# EAGLE design ESPmotorver4 (EAGLE 9.6.2)
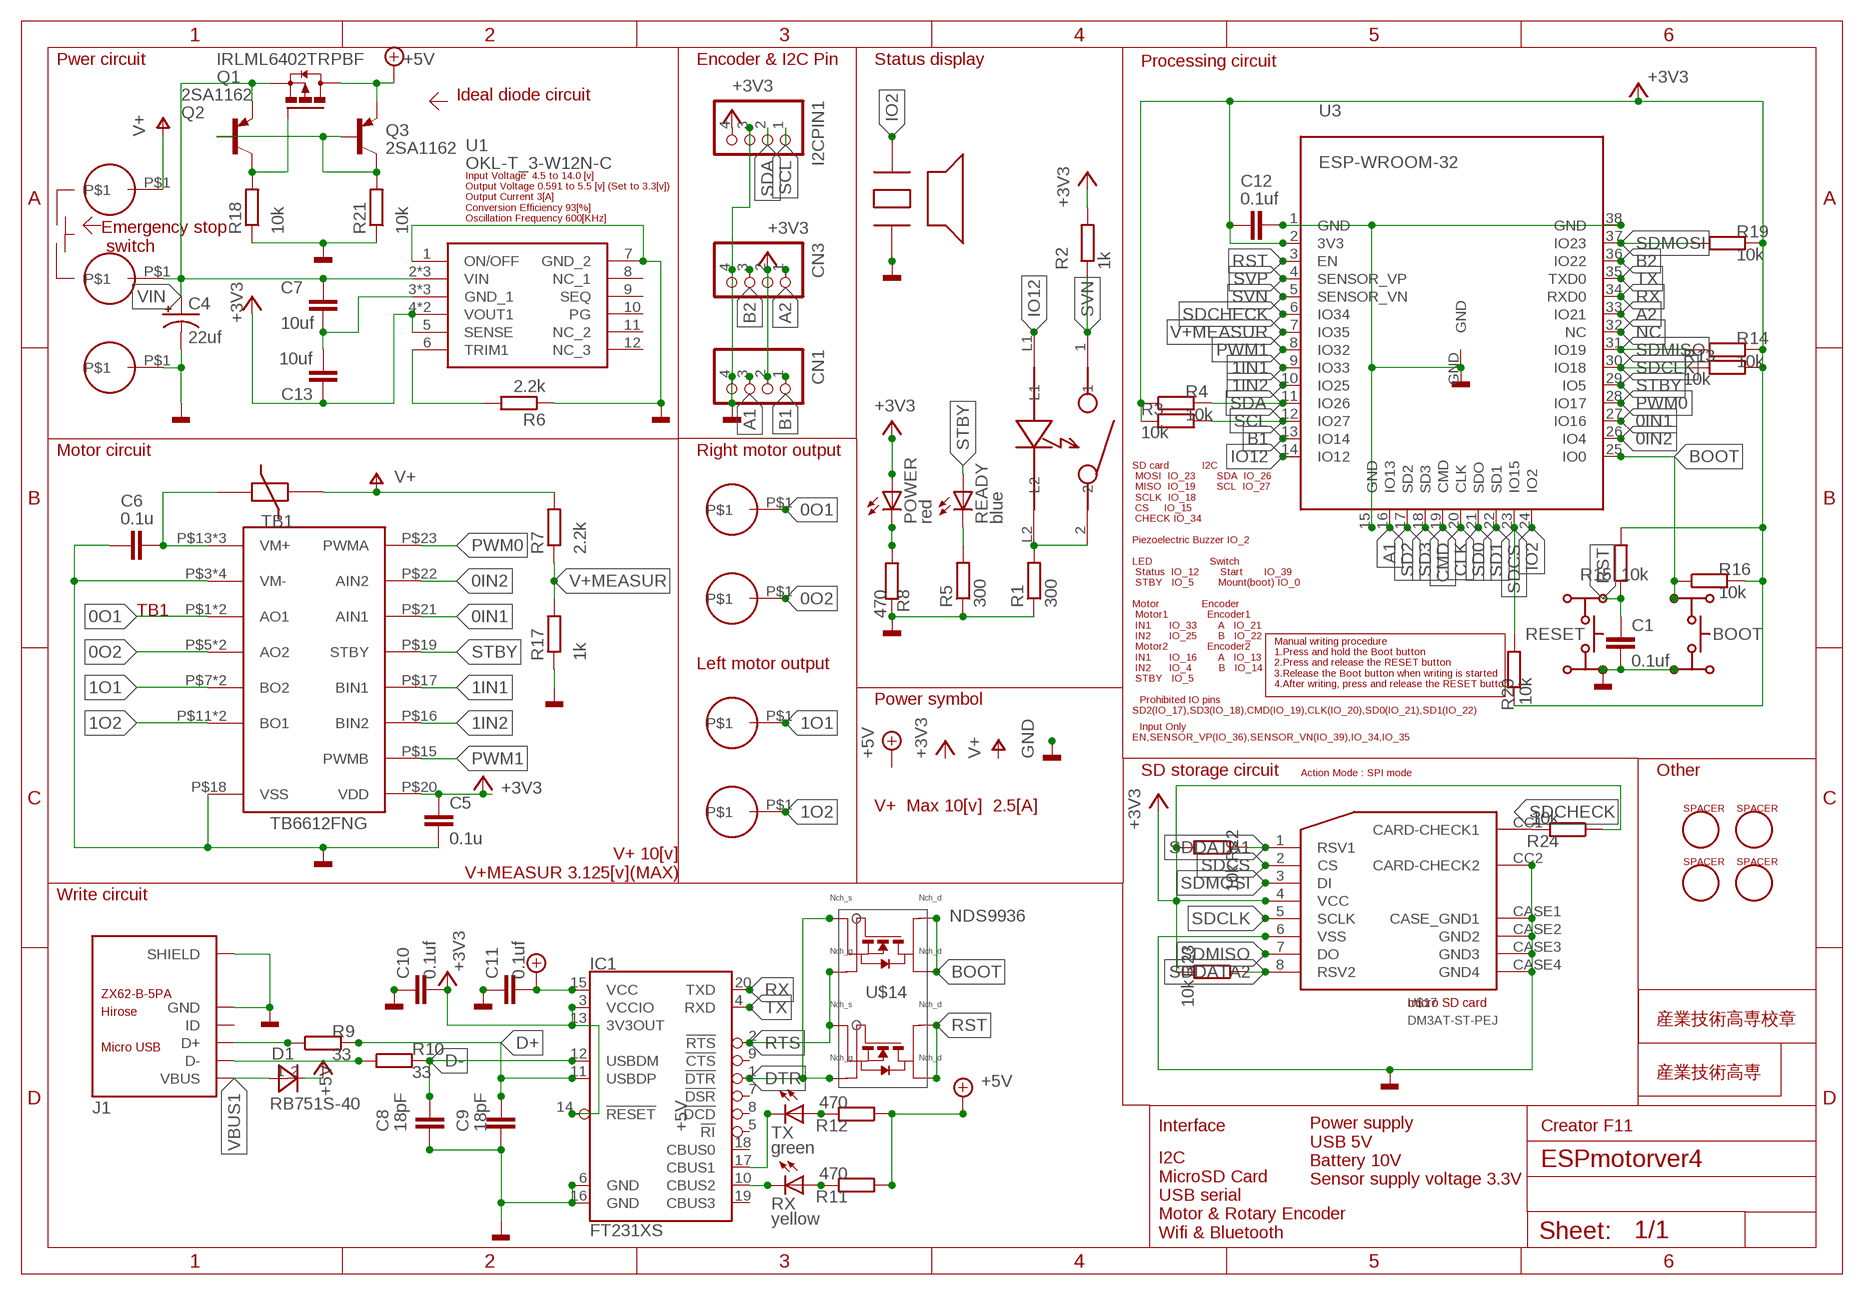
[diagram p0: schematic, sheet 1]

## Parts
BOOT  TACTSWITCH-4PSKRP  [SKRP]
C1  0.1uf  C-EUC0603K  [C0603K]
C4  22uf  CPOL-USCT3528  [CT3528]
C5  0.1u  C-EUC0603  [C0603]
C6  0.1u  C-EUC0603  [C0603]
C7  10uf  C-EUC0805  [C0805]
C8  18pF  C-EUC0603  [C0603]
C9  18pF  C-EUC0603  [C0603]
C10  0.1uf  C-EUC0603K  [C0603K]
C11  0.1uf  C-EUC0603K  [C0603K]
C12  0.1uf  C-EUC0603K  [C0603K]
C13  10uf  C-EUC0805  [C0805]
CN1  S4B-XH-A  [S4B-XH-A]
CN3  S4B-XH-A  [S4B-XH-A]
D1  RB751S-40  [EMD2]
EM  PV-3  [PV-3]
GND  PV-3  [PV-3]
I2CPIN1  S4B-XH-A  [S4B-XH-A]
IC1  FT231XS  [SSOP20]
J1  ZX62-B-5PA  [ZX62-B-5PA(11)]
POWER  red  LEDCHIPLED_0805  [CHIPLED_0805]
Q1  IRLML6402TRPBF  [SOT23]
Q2  2SA1162  MMUN2114LT1  [SC59-BEC]
Q3  2SA1162  MMUN2114LT1  [SC59-BEC]
R1  300  R-EU_R0603  [R0603]
R2  1k  R-EU_R0603  [R0603]
R3  10k  R-EU_R0603  [R0603]
R4  10k  R-EU_R0603  [R0603]
R5  300  R-EU_R0603  [R0603]
R6  2.2k  R-EU_R0603  [R0603]
R7  2.2k  R-EU_R0603  [R0603]
R8  470  R-EU_R0603  [R0603]
R9  33  R-EU_R0603  [R0603]
R10  33  R-EU_R0603  [R0603]
R11  470  R-EU_R0603  [R0603]
R12  470  R-EU_R0603  [R0603]
R13  10k  R-EU_R0603  [R0603]
R14  10k  R-EU_R0603  [R0603]
R15  10k  R-EU_R0603  [R0603]
R16  10k  R-EU_R0603  [R0603]
R17  1k  R-EU_R0603  [R0603]
R18  10k  R-EU_R0603  [R0603]
R19  10k  R-EU_R0603  [R0603]
R20  10k  R-EU_R0603  [R0603]
R21  10k  R-EU_R0603  [R0603]
R22  10k  R-EU_R0603  [R0603]
R23  10k  R-EU_R0603  [R0603]
R24  10k  R-EU_R0603  [R0603]
READY  blue  LEDCHIPLED_0805  [CHIPLED_0805]
RESET  TACTSWITCH-4PSKRP  [SKRP]
RX  yellow  LEDCHIPLED_0805  [CHIPLED_0805]
SW  TSHD-T2.8T2  [LEDSWITCH]
TB1  TB6612FNG  [TB6612FNG]
TX  green  LEDCHIPLED_0805  [CHIPLED_0805]
U1  OKL-T_3-W12N-C  [OKL-T3-W12]
U3  ESP-WROOM-32  [ESP-WROOM-32]
U$1  SCHOOLMARK1  [SCHOOLMARK1]
U$3  SCHOOLMARK2  [SCHOOLMARK2]
U$6  PKLCS1212E4001-R1  [SMD_SOUNDER]
U$7  PV-3  [PV-3]
U$8  SPACER  [SPACER]
U$9  PV-3  [PV-3]
U$10  PV-3  [PV-3]
U$11  SPACER  [SPACER]
U$12  SPACER  [SPACER]
U$13  SPACER  [SPACER]
U$14  NDS9936  [SO-8]
U$15  PV-3  [PV-3]
U$16  SMD1812  [SMD1812]
U$17  DM3AT-ST-PEJ  [DM3AT-SF-PEJ]
VIN  PV-3  [PV-3]

## Nets
0IN1: TB1.P$21(AIN1) U3.27(IO16)
0IN2: TB1.P$22(AIN2) U3.26(IO4)
0O1: TB1.P$1(AO1) TB1.P$2(AO1) U$7.P$1
0O2: TB1.P$5(AO2) TB1.P$6(AO2) U$9.P$1
1IN1: TB1.P$17(BIN1) U3.9(IO33)
1IN2: TB1.P$16(BIN2) U3.10(IO25)
1O1: TB1.P$7(BO2) TB1.P$8(BO2) U$10.P$1
1O2: TB1.P$11(BO1) TB1.P$12(BO1) U$15.P$1
+3V3: C5.1 C10.2 C12.2 C13.1 CN1.2 CN3.2 I2CPIN1.4 IC1.3(VCCIO) IC1.13(3V3OUT) IC1.14(!RESET) POWER.A R2.2 R3.1 R4.1 R13.2 R14.2 R15.2 R16.2 R19.2 R20.1 R22.2 R23.2 R24.1 TB1.P$20(VDD) U1.4(VOUT1) U1.5(SENSE) U1.17(VOUT1) U3.2(3V3) U$17.4(VCC)
+5V: C11.2 D1.2(C) IC1.15(VCC) Q1.3(D) Q3.E R11.1 R12.1
A1: CN1.3 U3.16(IO13)
A2: CN3.1 U3.33(IO21)
B1: CN1.1 U3.13(IO14)
B2: CN3.3 U3.36(IO22)
BOOT: BOOT.4 R16.1 U3.25(IO0) U$14.7 U$14.8
CLK: U3.20(CLK)
CMD: U3.19(CMD)
D+: C9.1 IC1.11(USBDP) R9.2
D-: C8.1 IC1.12(USBDM) R10.2
DTR: IC1.1(!DTR) U$14.1 U$14.4
GND: BOOT.2 C1.2 C4.- C5.2 C6.2 C7.2 C8.2 C9.2 C10.1 C11.1 C12.1 C13.2 CN1.4 CN3.4 GND.P$1 I2CPIN1.3 IC1.6(GND) IC1.16(GND) J1.5(GND) J1.SH1(SHIELD) J1.SH2(SHIELD) J1.SH3(SHIELD) J1.SH4(SHIELD) J1.SH5(SHIELD) J1.SH6(SHIELD) R1.1 R5.1 R6.1 R8.2 R17.1 R18.1 R21.1 RESET.1 TB1.P$3(VM-) TB1.P$4(VM-) TB1.P$9(VM-) TB1.P$10(VM-) TB1.P$18(VSS) U1.1(ON/OFF) U1.3(GND_1) U1.7(GND_2) U1.15(GND_1) U1.16(GND_1) U3.1(GND) U3.15(GND) U3.38(GND) U3.GND U$6.P$2 U$17.6(VSS) U$17.CASE1(CASE_GND1) U$17.CASE2(GND2) U$17.CASE3(GND3) U$17.CASE4(GND4) U$17.CC2(CARD-CHECK2)
IO2: U3.24(IO2) U$6.P$1
IO12: SW.L1 U3.14(IO12)
N$1: R1.2 SW.2 SW.L2
N$2: J1.2(D-) R10.1
N$3: C6.1 TB1.P$13(VM+) TB1.P$14(VM+) TB1.P$24(VM+) U$16.P$2
N$4: R6.2 U1.6(TRIM1)
N$5: J1.3(D+) R9.1
N$6: Q2.B Q3.B Q3.C R21.2
N$7: R5.2 READY.C
N$8: Q1.1(G) Q2.C R18.2
N$10: R11.2 RX.A
N$12: IC1.10(CBUS2) RX.C
N$13: R12.2 TX.A
N$14: POWER.C R8.1
N$19: IC1.17(CBUS1) TX.C
NC: U3.32(NC)
PWM0: TB1.P$23(PWMA) U3.28(IO17)
PWM1: TB1.P$15(PWMB) U3.8(IO32)
RST: C1.1 R15.1 RESET.3 U3.3(EN) U$14.5 U$14.6
RTS: IC1.2(!RTS) U$14.2 U$14.3
RX: IC1.20(TXD) U3.34(RXD0)
SCL: I2CPIN1.1 R3.2 U3.12(IO27)
SD0: U3.21(SDO)
SD1: U3.22(SD1)
SD2: U3.17(SD2)
SD3: U3.18(SD3)
SDA: I2CPIN1.2 R4.2 U3.11(IO26)
SDCHECK: R24.2 U3.6(IO34) U$17.CC1(CARD-CHECK1)
SDCLK: R13.1 U3.30(IO18) U$17.5(SCLK)
SDCS: R20.2 U3.23(IO15) U$17.2(CS)
SDDATA1: R22.1 U$17.1(RSV1)
SDDATA2: R23.1 U$17.8(RSV2)
SDMISO: R14.1 U3.31(IO19) U$17.7(DO)
SDMOSI: R19.1 U3.37(IO23) U$17.3(DI)
STBY: READY.A TB1.P$19(STBY) U3.29(IO5)
SVN: R2.1 SW.1 U3.5(SENSOR_VN)
SVP: U3.4(SENSOR_VP)
TX: IC1.4(RXD) U3.35(TXD0)
V+: EM.P$1 R7.2 U$16.P$1
V+MEASUR: R7.1 R17.2 U3.7(IO35)
VBUS1: D1.1(A) J1.1(VBUS)
VIN: C4.+ C7.1 Q1.2(S) Q2.E U1.2(VIN) U1.13(VIN) U1.14(VIN) VIN.P$1
Unconnected: BOOT.1 BOOT.3 IC1.5(!RI) IC1.7(!DSR) IC1.8(!DCD) IC1.9(!CTS) IC1.18(CBUS0) IC1.19(CBUS3) J1.4(ID) RESET.2 RESET.4 U1.8(NC_1) U1.9(SEQ) U1.10(PG) U1.11(NC_2) U1.12(NC_3)

## Notes on the sheet
- Pwer circuit | Encoder & I2C Pin | Status display | Processing circuit
- Ideal diode circuit
- Input Voltage  4.5 to 14.0 [v]
  Output Voltage 0.591 to 5.5 [v] (Set to 3.3[v])
  Output Current 3[A]
  Conversion Efficiency 93[%]
  Oscillation Frequency 600[KHz]
- Emergency stop
   switch
- Motor circuit | Right motor output
- Left motor output
- Manual writing procedure
  1.Press and hold the Boot button
  2.Press and release the RESET button
  3.Release the Boot button when writing is started
  4.After writing, press and release the RESET button
- Power symbol
- SD card           I2C
   MOSI  IO_23       SDA  IO_26
   MISO  IO_19       SCL  IO_27
   SCLK  IO_18
   CS     IO_15
   CHECK IO_34
  
  Piezoelectric Buzzer IO_2
  
  LED                   Switch
   Status  IO_12       Start       IO_39
   STBY   IO_5        Mount(boot) IO_0
  
  Motor              Encoder
   Motor1             Encoder1
   IN1      IO_33       A   IO_21
   IN2      IO_25       B   IO_22
   Motor2             Encoder2
   IN1      IO_16       A   IO_13
   IN2      IO_4         B   IO_14
   STBY   IO_5 
  
  ※Prohibited IO pins
  SD2(IO_17),SD3(IO_18),CMD(IO_19),CLK(IO_20),SD0(IO_21),SD1(IO_22)
- ※Input Only
  EN,SENSOR_VP(IO_36),SENSOR_VN(IO_39),IO_34,IO_35
- SD storage circuit | Action Mode : SPI mode | Other
- V+  Max 10[v]  2.5[A]
- V+ 10[v]
  V+MEASUR 3.125[v](MAX)
- Write circuit
- Interface | Creator F11
- Power supply
  USB 5V
  Battery 10V
  Sensor supply voltage 3.3V
- I2C
  MicroSD Card
  USB serial
  Motor & Rotary Encoder
  Wifi & Bluetooth

## Library data of the parts
BOOT RESET = alps:TACTSWITCH-4P
C1 C5-C13 = rcl:C-EU: CAPACITOR, European symbol; SPICEPREFIX: C
C4 = rcl:CPOL-US: POLARIZED CAPACITOR, American symbol; SPICEPREFIX: C
CN1 CN3 I2CPIN1 = jst-xh:S4B-XH-A: Wire-to-Board 2.5mm pitch side mount connector Source: http://www.jst-mfg.com/product/pdf/jpn/XH.pdf http://www.jst-mfg.com/product/detail.php?series=277
D1 = Diode:RB751S-40: Schottky Barrier Diode ROHM Product Electrical character @Ta = 25℃ Index Symbol Typ. Unit ドロップ電圧 VF 0.5 V 逆電流 IF 0.5 μA 端子間容量 CT 3.9 pF 平均清流電流 IO 50(30) pF For memo..... Index Symbol Typ. Unit
EM GND U$7 U$9 U$10 U$15 VIN = MD-Parts:PV-3
IC1 = ftdi:FT231XS: FTDI FT231X Full Speed USB to Full-handshake UART This USB2.0 Full Speed IC offers a compact bridge to full handshake UART interfaces. The device is a UART, capable of operating up to 3MBaud, with low power consumption (8mA). The FT231X includes the complete FT-X series feature set and enables USB to be added into a system design quickly and easily over a UART interface. See: http://www.ftdichip.com/Products/ICs/FT231X.html
J1 = hirose:ZX62-B-5PA
POWER READY RX TX = led:LED: LED OSRAM: - CHIPLED LG R971, LG N971, LY N971, LG Q971, LY Q971, LO R971, LY R971 LH N974, LH R974 LS Q976, LO Q976, LY Q976 LO Q996 - Hyper CHIPLED LW Q18S LB Q993, LB Q99A, LB R99A - SideLED LS A670, LO A670, LY A670, LG A670, LP A670 LB A673, LV A673, LT A673, LW A673 LH A674 LY A675 LS A676, LA A676, LO A676, LY A676, LW A676 LS A679, LY A679, LG A679 - Hyper Micro SIDELED® LS Y876, LA Y876, LO Y876, LY Y876 LT Y87S - SmartLED LW L88C, LW L88S LB L89C, LB L89S, LG L890 LS L89K, LO L89K, LY L89K LS L896, LA L896, LO L896, LY L896 - TOPLED LS T670, LO T670, LY T670, LG T670, LP T670 LSG T670, LSP T670, LSY T670, LOP T670, LYG T670 LG T671, LOG T671, LSG T671 LB T673, LV T673, LT T673, LW T673 LH T674 LS T676, LA T676, LO T676, LY T676, LB T676, LH T676, LSB T676, LW T676 LB T67C, LV T67C, LT T67C, LS T67K, LO T67K, LY T67K, LW E67C LS E67B, LA E67B, LO E67B, LY E67B, LB E67C, LV E67C, LT E67C LW T67C LS T679, LY T679, LG T679 LS T770, LO T770, LY T770, LG T770, LP T770 LB T773, LV T773, LT T773, LW T773 LH T774 LS E675, LA E675, LY E675, LS T675 LS T776, LA T776, LO T776, LY T776, LB T776 LHGB T686 LT T68C, LB T68C - Hyper Mini TOPLED® LB M676 - Mini TOPLED Santana® LG M470 LS M47K, LO M47K, LY M47K Source: http://www.osram.convergy.de LUXEON: - LUMILED® LXK2-PW12-R00, LXK2-PW12-S00, LXK2-PW14-U00, LXK2-PW14-V00 LXK2-PM12-R00, LXK2-PM12-S00, LXK2-PM14-U00 LXK2-PE12-Q00, LXK2-PE12-R00, LXK2-PE12-S00, LXK2-PE14-T00, LXK2-PE14-U00 LXK2-PB12-K00, LXK2-PB12-L00, LXK2-PB12-M00, LXK2-PB14-N00, LXK2-PB14-P00, LXK2-PB14-Q00 LXK2-PR12-L00, LXK2-PR12-M00, LXK2-PR14-Q00, LXK2-PR14-R00 LXK2-PD12-Q00, LXK2-PD12-R00, LXK2-PD12-S00 LXK2-PH12-R00, LXK2-PH12-S00 LXK2-PL12-P00, LXK2-PL12-Q00, LXK2-PL12-R00 Source: www.luxeon.com KINGBRIGHT: KA-3528ASYC Source: www.kingbright.com
Q1 = IRLML6402:IRLML6402: HEXFET P-Channel Power MOSFET; AVAILABILITY: Unavailable; DESCRIPTION: P-Channel 20V 3.7A (Ta) 1.3W (Ta) Surface Mount Micro3™/SOT-23; MF: Infineon Technologies; MP: IRLML6402; PACKAGE: SC-59 Infineon Technologies; PRICE: None
Q2 Q3 = transistor-pnp:MMUN2114*: PNP Transistror
R1-R24 = rcl:R-EU_: RESISTOR, European symbol; SPICEPREFIX: R
SW = LEDswitch:TSHD-T2.8T2
TB1 = TB6612FNG:TB6612FNG
U1 = OKL-T_3-W12N-C:OKL-T_3-W12N-C: DC/DC conv.,PoL,4.5-14Vin,0.591-5.5Vo 3A Non-Isolated DC-DC Converter 12V dc Input, 0.591 5.5V dc Output, 3A Source: Datasheet <https://componentsearchengine.com/Datasheets/3/OKL-T_3-W12N-C.pdf>; ARROW_PART_NUMBER: OKL-T/3-W12N-C; ARROW_PRICE-STOCK: https://www.arrow.com/en/products/okl-t3-w12n-c/murata-power-solutions; DESCRIPTION: DC/DC conv.,PoL,4.5-14Vin,0.591-5.5Vo 3A Non-Isolated DC-DC Converter 12V dc Input, 0.591 5.5V dc Output, 3A; HEIGHT: mm; MANUFACTURER_NAME: Murata Electronics; MANUFACTURER_PART_NUMBER: OKL-T/3-W12N-C; RS_PART_NUMBER: 1670629; RS_PRICE-STOCK: http://uk.rs-online.com/web/p/products/1670629
U3 = esp32:ESP-WROOM-32
U$1 = Design:SCHOOLMARK1
U$3 = Design:SCHOOLMARK2
U$6 = sounder:PKLCS1212E4001-R1
U$8 U$11-U$13 = tanaka:SPACER
U$14 = DUALFET:NDS9936
U$16 = PTC:SMD1812
U$17 = SD_Card_Socket:DM3AT-ST-PEJ: DM3AT-SF-PEJ DM3AT series , microSD card socket Producted by Hirose(HRS).Co CC : card check (closed at insert ; short CC1 and CC2)

## Board
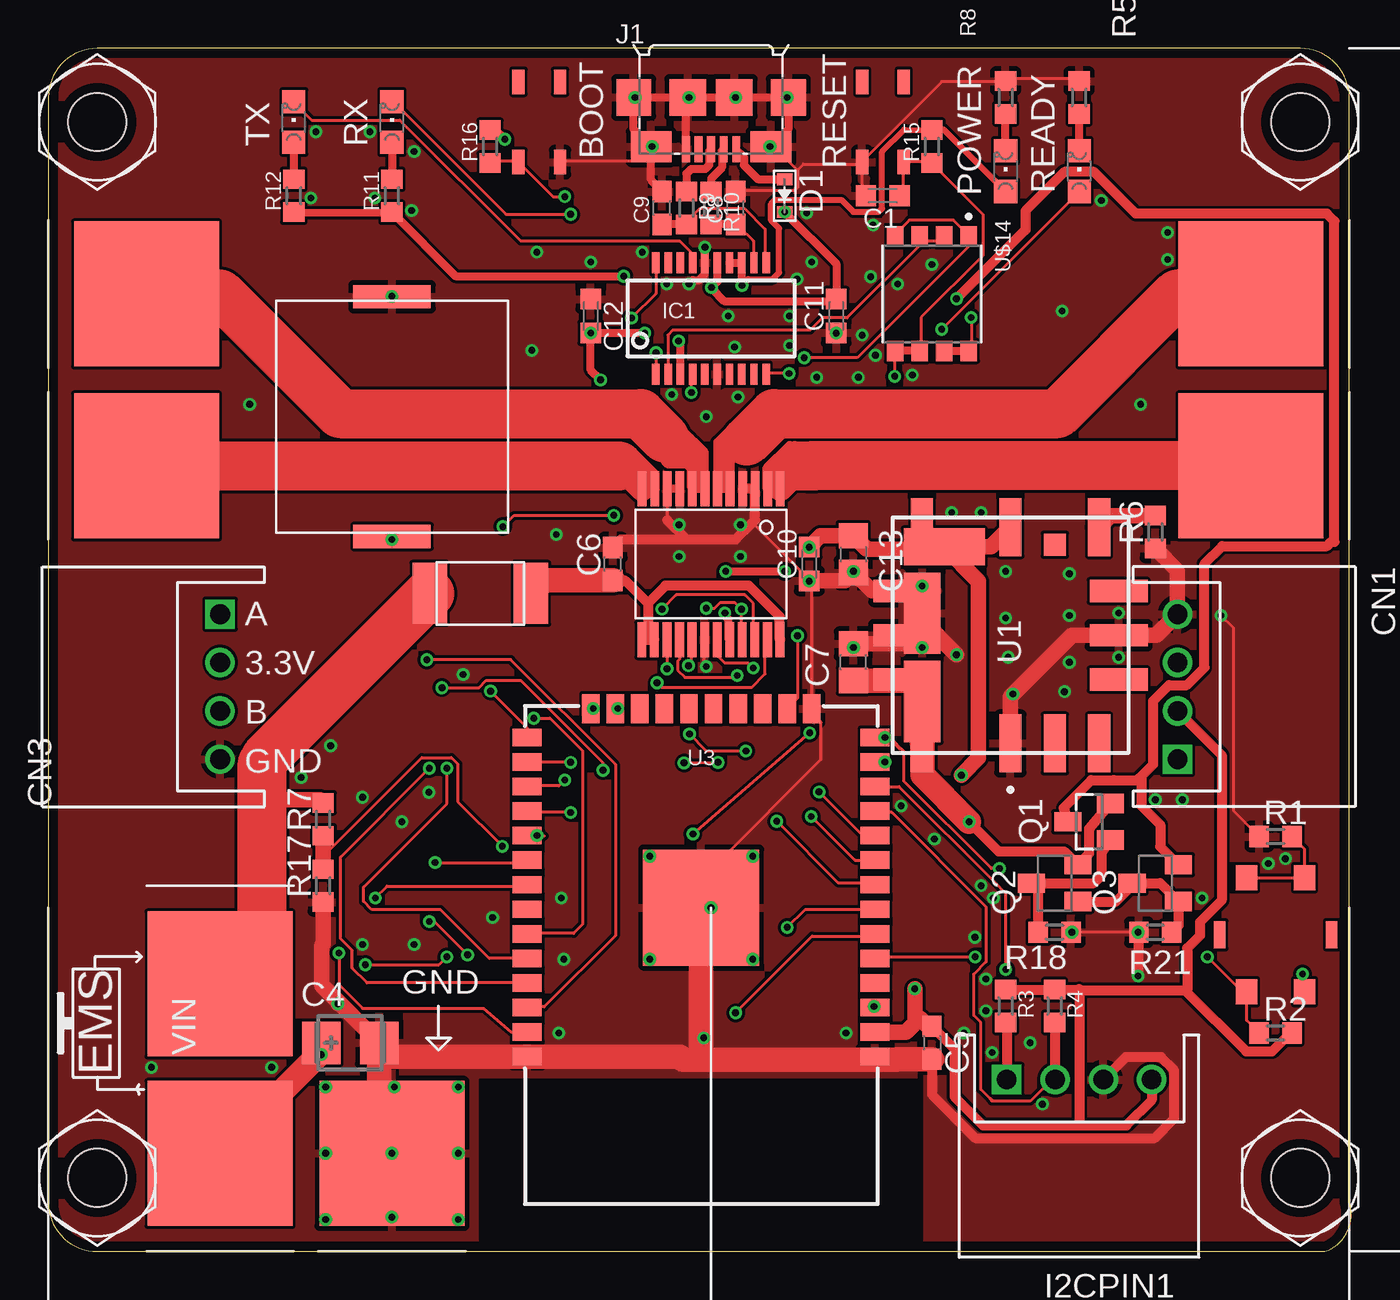
[diagram p1: board, top side]
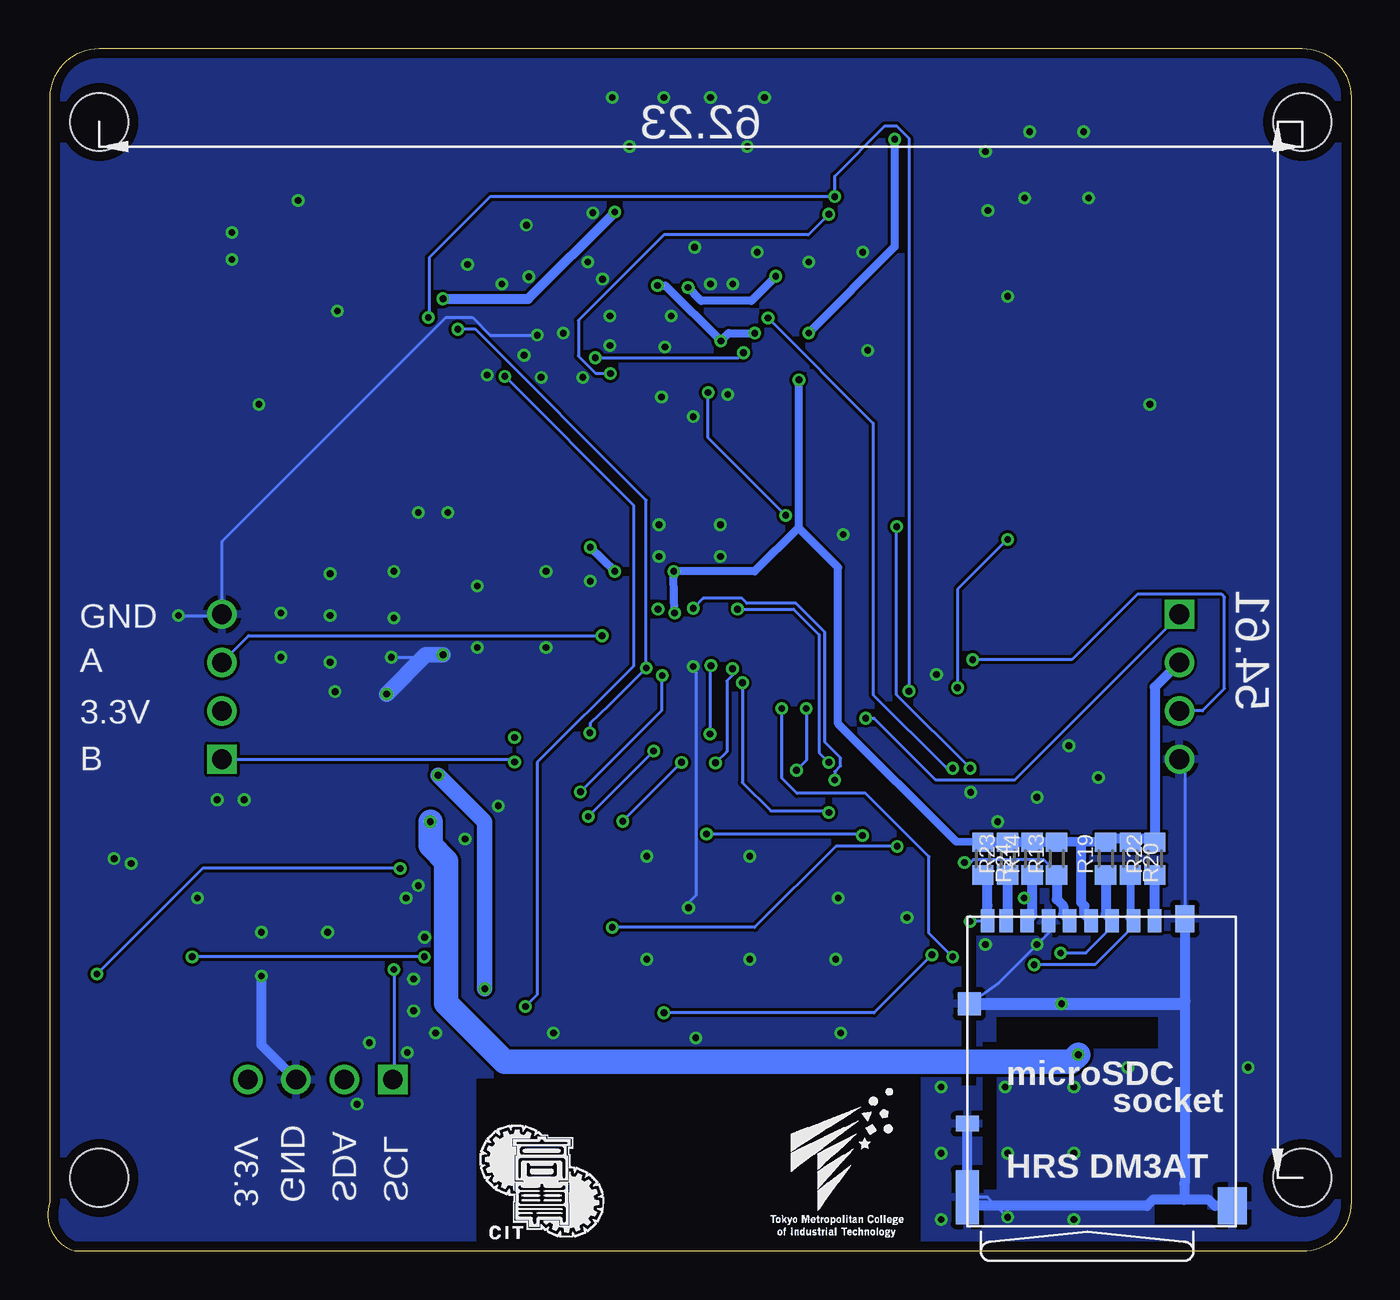
[diagram p2: board, bottom side, seen from below]

Size 67.41 x 62.23 mm. Coordinates in mm from the lower left corner, seen from the top.
Outline: 0,59.69 0,2.54 arc90 2.54,0 66.04,0 arc90 67.31,2.54 67.31,59.69 arc90 64.77,62.23 2.54,62.23 arc90 0,59.69
Copper layers (1*16): Top 0.035mm / dielectric 1.6mm / Bottom 0.035mm
Design rules "Elecrow_2-layer_PCB_eagle_rule": minimum track width 6mil, minimum drill 12mil, track to track 6mil, track to pad 6mil, pad to pad 6mil, via to via 8mil, smd to smd 0mil, copper to edge 20mil, drill to drill 10mil, minimum pad ring 6mil, minimum via ring 6mil, stop-mask expansion 0mil, vias tented up to drill 100mil, thermal gap 10mil

### Footprints (pad centres in the part's own frame; a part is rotated, then mirrored left to right if it is on the bottom)
SKRP = smd 1.27 x 0.635: 1 -2.075,1.075; 2 2.075,1.075; 3 -2.075,-1.075; 4 2.075,-1.075
C0603K = smd 1.05 x 1.08: 1 -0.875,0; 2 0.875,0
CT3528 = smd 2 x 2.2: + -1.5,0; - 1.5,0
C0603 = smd 1.1 x 1: 1 -0.85,0; 2 0.85,0
C0805 = smd 1.3 x 1.5: 1 -0.95,0; 2 0.95,0
S4B-XH-A = drill 1.016 square: 1 3.75,0 | drill 1.016: 2 1.25,0; 3 -1.25,0; 4 -3.75,0
EMD2 = smd 0.8 x 0.6: 1 0,-0.85; 2 0,0.85
PV-3 = smd 7.5 x 7.5: P$1 0,0
SSOP20 = smd 0.381 x 1.093: 1 -2.857,-2.88; 2 -2.223,-2.88; 3 -1.587,-2.88; 4 -0.953,-2.88; 5 -0.318,-2.88; 6 0.318,-2.88; 7 0.953,-2.88; 8 1.587,-2.88; 9 2.223,-2.88; 10 2.857,-2.88; 11 2.857,2.88; 12 2.223,2.88; 13 1.587,2.88; 14 0.953,2.88; 15 0.318,2.88; 16 -0.318,2.88; 17 -0.953,2.88; 18 -1.587,2.88; 19 -2.223,2.88; 20 -2.857,2.88
ZX62-B-5PA(11) = smd 0.4 x 1.35: 1 -1.3,2.675; 2 -0.65,2.675; 3 0,2.675; 4 0.65,2.675; 5 1.3,2.675 | smd 2.1 x 1.6: SH1 -3.1,2.55; SH2 3.1,2.55 | smd 1.8 x 1.9: SH3 -4,0; SH6 4,0 | smd 1.9 x 1.9: SH4 -1.2,0; SH5 1.2,0
CHIPLED_0805 = smd 1.2 x 1.2: A 0,-1.05; C 0,1.05
SOT23 = smd 1 x 1.4: 1 -0.95,-1.1; 2 0.95,-1.1; 3 0,1.1
SC59-BEC = smd 1 x 1.4: B -0.95,-1.2; C 0,1.2; E 0.95,-1.2
R0603 = smd 1 x 1.1: 1 -0.85,0; 2 0.85,0
LEDSWITCH = smd 1.1 x 1.3: 1 -1.5,-2.95; 2 -1.5,2.95; L1 1.5,-2.95; L2 1.5,2.95 | smd 0.6 x 1.4: N 2.9,0; NN -2.9,0
TB6612FNG = smd 0.45 x 1.8: P$1 -3.583,-3.885; P$2 -2.933,-3.885; P$3 -2.283,-3.885; P$4 -1.633,-3.885; P$5 -0.983,-3.885; P$6 -0.333,-3.885; P$7 0.318,-3.885; P$8 0.968,-3.885; P$9 1.617,-3.885; P$10 2.268,-3.885; P$11 2.917,-3.885; P$12 3.567,-3.885; P$13 3.583,3.915; P$14 2.933,3.915; P$15 2.283,3.915; P$16 1.633,3.915; P$17 0.983,3.915; P$18 0.333,3.915; P$19 -0.318,3.915; P$20 -0.968,3.915; P$21 -1.617,3.915; P$22 -2.268,3.915; P$23 -2.917,3.915; P$24 -3.567,3.915
OKL-T3-W12 = smd 3 x 1.15: 1 -5.595,0; 5 5.595,0; 6 5.595,-4.58; 9 -5.595,-4.58; 10 -5.595,-2.29; 13 -5.595,4.58; 17 5.595,4.58 | smd 4.19 x 1.91: 2 -3.43,4.57; 3 1.14,4.57 | smd 1.91 x 4.19: 4 4.57,3.43 | smd 1.15 x 3: 7 0,-5.595; 8 -2.29,-5.595; 12 2.29,-5.595; 14 -2.29,5.595; 15 0,5.595; 16 2.29,5.595 | smd 1.15 x 1.15: 11 4.68,-2.29
ESP-WROOM-32 = smd 0.9 x 1.5: 1 7.7,9; 2 6.43,9; 3 5.16,9; 4 3.89,9; 5 2.62,9; 6 1.35,9; 7 0.08,9; 8 -1.19,9; 9 -2.46,9; 10 -3.73,9; 11 -5,9; 12 -6.27,9; 13 -7.54,9; 14 -8.81,9; 25 -8.81,-9; 26 -7.54,-9; 27 -6.27,-9; 28 -5,-9; 29 -3.73,-9; 30 -2.46,-9; 31 -1.19,-9; 32 0.08,-9; 33 1.35,-9; 34 2.62,-9; 35 3.89,-9; 36 5.16,-9; 37 6.43,-9; 38 7.7,-9 | smd 1.5 x 0.9: 15 -10.3,5.715; 16 -10.3,4.445; 17 -10.3,3.175; 18 -10.3,1.905; 19 -10.3,0.635; 20 -10.3,-0.635; 21 -10.3,-1.905; 22 -10.3,-3.175; 23 -10.3,-4.445; 24 -10.3,-5.715 | smd 6 x 6: GND 0,0
SMD_SOUNDER = smd 1.2 x 4: P$1 -6.2,0; P$2 6.2,0
SPACER = hole 3: 0,0
SO-8 = smd 1.05 x 0.85: 1 -2.979,1.905; 2 -2.979,0.635; 3 -2.979,-0.635; 4 -2.979,-1.905; 5 2.95,-1.905; 6 2.95,-0.635; 7 2.95,0.635; 8 2.95,1.905
SMD1812 = smd 1.78 x 3.15: P$1 2.615,0; P$2 -2.615,0
DM3AT-SF-PEJ = smd 0.7 x 1.2: 1 0,0.6; 2 -1.1,0.6; 3 -2.2,0.6; 4 -3.3,0.6; 5 -4.4,0.6; 6 -5.5,0.6; 7 -6.6,0.6; 8 -7.7,0.6; CC1 -8.65,0.6 | smd 1.2 x 2.8: CASE1 -9.7,-13.7 | smd 1.5 x 1.9: CASE2 4,-14.15 | smd 1 x 1.4: CASE3 1.55,0.7 | smd 1.2 x 1.2: CASE4 -9.6,-3.7 | smd 1.2 x 0.8: CC2 -9.7,-9.9

### Placement (x,y rotation side)
BOOT  25.4,58.42 270 top
C1  43.18,54.61 180 top
C4  15.62,10.79 0 top
C5  45.72,10.79 270 top
C6  29.21,35.56 90 top
C7  41.66,30.48 90 top
C8  35.56,53.98 90 top
C9  31.75,53.98 90 top
C10  39.37,35.56 90 top
C11  40.77,48.39 90 top
C12  28.07,48.39 270 top
C13  41.66,36.07 270 top
CN1  58.42,29.21 270 top
CN3  8.89,29.21 90 top
D1  38.1,54.61 180 top
EM  8.89,13.84 270 top
GND  17.78,5.08 90 top
I2CPIN1  53.34,8.89 180 top
IC1  34.29,48.26 0 top
J1  34.29,59.69 180 top
POWER  49.53,55.88 0 top
Q1  53.85,22.23 90 top
Q2  52.07,19.05 90 top
Q3  57.28,19.05 90 top
R1  63.5,21.46 0 top
R2  63.5,11.3 0 top
R3  49.53,12.7 270 top
R4  52.07,12.7 270 top
R5  53.34,59.69 270 top
R6  57.28,37.21 90 top
R7  14.22,22.35 90 top
R8  49.53,59.69 90 top
R9  33.02,53.98 270 top
R10  34.29,53.98 270 top
R11  17.78,54.61 90 top
R12  12.7,54.61 90 top
R13  15.24,20.32 90 bottom
R14  16.51,20.32 90 bottom
R15  45.72,57.15 90 top
R16  22.86,57.15 90 top
R17  14.22,18.92 90 top
R18  52.07,16.51 180 top
R19  12.7,20.32 90 bottom
R20  11.43,20.32 270 bottom
R21  57.28,16.51 0 top
R22  10.16,20.32 90 bottom
R23  17.78,20.32 90 bottom
R24  19.05,20.32 270 bottom
READY  53.34,55.88 0 top
RESET  43.18,58.42 90 top
RX  17.78,58.42 0 top
SW  63.5,16.38 0 top
TB1  34.29,35.56 180 top
TX  12.7,58.42 0 top
U1  49.78,31.88 90 top
U3  33.78,17.78 270 top
U$1  45.09,0.64 0 bottom
U$3  30.1,0.76 0 bottom
U$6  17.78,43.18 90 top
U$7  62.23,40.64 180 top
U$8  64.77,58.42 0 top
U$9  62.23,49.53 180 top
U$10  5.08,49.53 0 top
U$11  64.77,3.81 0 top
U$12  2.54,3.81 0 top
U$13  2.54,58.42 0 top
U$14  45.72,49.53 270 top
U$15  5.08,40.64 0 top
U$16  22.35,34.04 180 top
U$17  10.16,16.51 0 bottom
VIN  8.89,5.08 90 top

### Tracks (layer width: path | path; a pad name or v marks a point on that pad's centre or on a via)
0IN1  (via drill 0.35)
  Top 0.152: v26.72,24.38 26.42,24.08 24.84,24.08 U3.27 | TB1.P$21 35.86,31.7 v35.86,33.22 35.51,33.58 34.78,33.58 34.47,33.27 v34.04,33.27
  Bottom 0.152: v26.72,24.38 26.72,24.82 26.42,25.12 26.42,25.53 27.23,26.34 27.23,32.03 28.73,33.53 31.27,33.53 31.52,33.78 33.53,33.78 v34.04,33.27 | v35.86,33.22 35.81,33.27
0IN2  (via drill 0.35)
  Top 0.152: v27.03,25.3 24.84,25.3 U3.26 | v31.75,33.22 32.49,33.96 36.04,33.96 36.47,33.53 36.47,31.7 TB1.P$22
  Bottom 0.152: v27.03,25.3 27.53,25.81 27.53,31.9 28.85,33.22 v31.75,33.22
0O1
  Top 0.406: TB1.P$2 TB1.P$1
  Top 0.508: TB1.P$2 37.22,40.52 38.35,41.66 38.61,41.66 | 38.35,41.4 38.61,41.4 39.37,40.64 | TB1.P$2 37.29,39.51 37.29,40.33 37.59,40.64 | 37.59,40.64 37.87,40.92 | 37.87,40.92 38.35,41.4 | 38.35,41.4 38.61,41.66 | TB1.P$2 37.59,39.45 37.59,40.64 | 37.87,40.92 TB1.P$1 38.05,39.62 39.62,39.62 39.62,40.64 40.51,41.53 40.39,41.66 38.61,41.66
  Top 1.27: 39.37,40.64 39.07,40.64 TB1.P$1
  Top 2.54: U$7.P$1 39.62,40.64 39.37,40.64
0O2
  Top 0.406: TB1.P$6 TB1.P$5 | TB1.P$5 35.31,39.48 35.31,41.07 35.51,41.27 | TB1.P$5 35.27,40.39 | 35.27,40.39 35.27,40.77 | 35.27,40.77 35.27,41.21 34.62,41.86 | 34.62,40.09 TB1.P$6 | TB1.P$5 34.62,40.09 | 34.62,40.09 34.62,40.39 | 34.62,40.39 34.62,40.64 | 34.62,40.64 34.62,41.27 | 34.62,41.27 34.62,41.86 | TB1.P$6 34.62,39.74 35.27,40.39 | 35.27,40.39 34.62,40.39 | 34.62,40.64 34.75,40.77 35.13,40.77 | 35.27,40.77 35.13,40.77 | 35.13,40.77 34.62,41.27 | 36.15,41.91 35.51,41.27 | 35.51,41.27 34.62,41.27 | 34.62,41.86 36.09,43.33 37.57,43.33
  Top 2.54: U$9.P$1 58.42,49.53 52.22,43.33 37.57,43.33 36.15,41.91
1IN1  (via drill 0.35)
  Top 0.152: v36.09,25.88 34.06,25.88 v33.17,26.77 | v33.12,30.3 33.25,30.43 33.25,31.52 33.27,31.55 TB1.P$17 | v39.47,22.5 41.74,20.24 U3.9
  Bottom 0.152: v39.47,22.5 v36.09,25.88 | v33.12,30.3 33.17,30.25 v33.17,26.77
1IN2  (via drill 0.35)
  Top 0.152: v39.88,23.77 42.01,21.64 42.67,21.64 U3.10 | v35.64,29.8 35.54,29.7 32.94,29.7 32.57,30.07 32.57,30.53 32.66,30.62 TB1.P$16
  Bottom 0.152: 39.88,23.9 v39.88,23.77 35.69,27.96 35.69,29.75 v35.64,29.8
1O1
  Top 0.406: 31.91,41.51 31.91,40.86 32.07,40.7 32.72,40.7 | 33.25,40.16 33.25,39.51 TB1.P$8 TB1.P$7 | 31.91,41.51 31.91,42.07 32.67,41.31 | TB1.P$7 33.53,39.88 | 33.53,39.88 33.25,40.16 | 33.25,40.16 33.25,40.49 33.04,40.7 32.72,40.7 | 32.72,40.7 31.91,41.51 | 33.53,40.44 33.53,39.88 | 33.53,40.44 33.97,40 TB1.P$7 | 32.67,41.31 33.18,40.8 | 33.18,40.8 33.53,40.44 | TB1.P$7 33.97,40.64 | 33.97,40.64 33.97,41.02 | 33.97,41.02 33.97,41.34 33.53,41.78 | 33.21,42.1 31.88,43.43 | 33.53,40.44 33.53,41.78 | 33.53,41.78 33.21,42.1 | 33.21,42.1 33.21,41.78 | 33.21,41.78 33.97,41.02 | 33.97,40.64 33.31,41.31 | 33.21,41.78 33.21,41.4 33.31,41.31 | 32.67,41.31 33.31,41.31 | 33.97,40.64 33.77,40.44 33.53,40.44 | 33.18,40.8 33.31,40.93 33.31,41.31
  Top 0.508: 31.88,43.43 31.78,43.33 30.64,43.33
  Top 2.54: U$10.P$1 8.89,49.53 15.09,43.33 30.64,43.33 31.91,42.07
1O2
  Top 0.406: TB1.P$11 TB1.P$12
  Top 0.508: TB1.P$11 31.37,40.19 30.35,41.21 30.35,41.02 31.37,40.01 31.37,39.73 31.36,39.72 TB1.P$11
  Top 1.27: 29.53,40.64 TB1.P$12
  Top 2.54: U$15.P$1 29.53,40.64
+3V3  (via drill 0.35)
  Top 0.152: 35.25,51.21 IC1.14 | IC1.3 32.66,45.41 | v39.37,36.42 C10.2 | R15.2 45.62,57.92 45.62,57.91 | 45.44,11.37 45.61,11.54 C5.1 45.72,11.48 | U1.17 45.97,36.7 45.97,36.45 45.97,36.32 | 53.34,13.57 53.47,13.57 53.41,13.52 53.34,13.45 | 44.83,11.81 44.83,12.06 45.09,12.06
  Top 0.305: v35.89,49.96 36.22,50.29 37.46,50.29 37.81,50.63 37.81,52.92 37.39,53.33 37.39,54.19 37.6,54.39 41.03,54.39 41.65,53.77 42.96,53.77 43.13,53.94 43.13,56.87 44.29,58.02 R15.2 46.34,58.02 POWER.A
  Top 0.406: TB1.P$20 35.19,31.71 35.19,32.69 35.01,32.87 v35.01,33.02 | v35.05,35.18 v38.1,35.18 | IC1.14 IC1.13 35.88,49.97 v35.89,49.96 | v28.57,45.08 28.07,45.59 C12.2 28.08,47.5 v30.86,47.5 | IC1.3 32.7,47 v32.61,47.09 | R16.2 23.13,58.02 v23.62,57.53
  Top 0.508: R3.1 R4.1 53.34,13.57 53.34,6.53 | C5.1 46.89,10.48 46.89,8 48.36,6.53 53.34,6.53 | 53.34,6.53 55.78,6.53 57.09,7.83 I2CPIN1.4 | 53.41,13.52 58.81,13.52 | 58.81,13.52 58.93,13.52 58.93,15.69 59.58,16.34 59.58,17.03 60.71,18.16 60.71,25.67 CN1.2 | 58.81,13.52 61.98,10.35 63.32,10.35 64.27,11.3 R2.2
  Top 0.813: 45.97,36.32 42.64,36.32 42.64,36.33 42.35,36.33 C13.1 39.95,37.02 C10.2 | 45.97,36.45 U1.4 | U1.4 48.76,36.45 U1.5 | U1.4 48.13,34.67 48.13,25.53 v47.24,24.64 | v44.83,13.59 44.83,11.81 44.37,11.35 U3.2 | 45.09,12.06 45.61,11.54
  Bottom 0.152: 17.88,21.34 R23.2 17.73,21.34 | 18.95,21.34 R24.1 19.05,21.29 19.1,21.34 | 10.26,21.34 R22.2 10.11,21.34 | 13.46,17.22 U$17.4 | R13.2 15.24,21.29 15.29,21.34 | 12.7,21.34 R19.2 12.7,21.18 | 11.48,21.34 11.43,21.29 R20.1 11.43,21.23 11.33,21.34 | R14.2 16.51,21.34
  Bottom 0.406: v35.01,33.02 35.05,34.92 v35.05,35.18 30.86,35.18 28.6,37.44 | v38.1,35.18 v39.37,36.42 | R24.1 20.43,21.2 26.54,27.3 26.54,35.38 28.6,37.44 | 28.6,37.44 28.57,37.47 v28.57,45.08 | v30.86,47.5 32.21,47.5 v32.61,47.09 35.48,49.96 v35.89,49.96 | v23.62,57.53 23.62,51.96 C12.2
  Bottom 0.508: CN3.2 10.16,29.19 R22.2 10.3,21.34 11.48,21.34 | R20.1 11.57,21.34 12.7,21.34 | R19.2 13.97,21.2 | 13.97,21.2 R13.2 R14.2 R23.2 R24.1 | U$17.4 13.8,17.45 13.8,17.88 13.97,18.05 13.97,21.2
  Bottom 0.813: v47.24,24.64 44.83,22.23 v44.83,13.59
  other vias: 28.07,47.51
+5V  (via drill 0.35)
  Top 0.152: 38,53.65 D1.2 | 12.7,53.8 R12.1 | 17.73,53.8 R11.1 17.88,53.65
  Top 0.406: R12.1 17.79,53.73 17.88,53.65 | D1.2 40.77,51.09 C11.2 40.66,49.15 34.97,49.15 34.31,49.81 v34.31,49.86 34.61,50.15 IC1.15 | R11.1 21.07,50.44 v29.77,50.44
  Top 0.508: v46.99,49.28 50.56,52.84 50.56,53.82 52.57,55.84 54.11,55.84 56.26,53.69 66.15,53.69 66.55,53.29 66.55,36.7 66.37,36.7 66.15,36.48 60.74,36.48 59.82,35.56 59.82,30.2 58.9,29.29 57.99,29.29 57.17,28.48 57.17,25.2 56.5,24.52 | Q1.3 52.54,22.95 53.97,24.38 55.11,24.38 55.12,24.38 56.36,24.38 56.5,24.52 | 56.5,24.52 56.54,24.48 56.54,23.06 57.53,22.08 57.53,20.95 Q3.E
  Bottom 0.406: v29.77,50.44 31.04,49.17 33.63,49.17 v34.31,49.86
  Bottom 0.508: v46.99,49.28 42.58,49.28 D1.2
  other vias: 38.1,53.76
A1  (via drill 0.35)
  Top 0.152: v38.76,31.85 38.76,28.61 U3.16
  Bottom 0.152: v38.76,31.85 57.05,31.85 58.42,30.48 CN1.3
A2  (via drill 0.35)
  Top 0.152: v25.12,27.58 25.96,27.58 27.64,25.91 27.64,16.92 27.18,16.46 24.84,16.46 U3.33
  Bottom 0.152: v25.12,27.58 24.69,27.58 21.49,24.38 17.42,24.38 8.89,32.92 CN3.1
B1  (via drill 0.35)
  Top 0.152: 42.82,25.45 42.82,25.43 42.82,25.32 U3.13 v43.29,25.32
  Bottom 0.152: CN1.1 43.43,25.46 v43.29,25.32
B2  (via drill 0.35)
  Top 0.152: v19.58,30.61 23.93,30.61 29.34,25.2 29.34,16.33 25.65,12.65 24.84,12.65 U3.36
  Bottom 0.152: v19.58,30.61 14.45,30.61 11.07,33.98 6.71,33.98 6.55,33.83 6.55,29.11 7.7,27.96 CN3.3
BOOT  (via drill 0.35)
  Top 0.152: R16.1 22.91,56.39 24.28,56.39 BOOT.4 24.44,56.24 26.11,54.56 v26.72,54.56 | v47.75,48.31 47.75,46.63 U$14.8 | 25.01,26.86 U3.25 24.78,27.09 v22.89,28.98
  Top 0.406: U$14.7 U$14.8
  Bottom 0.152: v47.75,48.31 47.7,48.36 47.7,51.41 44.55,54.56 v26.72,54.56 26.72,55.63 24.13,58.22 23.52,58.22 22.89,57.58 v22.89,28.98
D+
  Top 0.152: IC1.11 37.08,51.21 37.08,52.88 36.02,53.95 33.73,53.95 32.97,53.19 R9.2
  Top 0.406: R9.2 C9.1
D-
  Top 0.152: IC1.12 36.47,51.21 36.47,52.27 35.71,53.03 C8.1
  Top 0.406: C8.1 R10.2
DTR  (via drill 0.35)
  Top 0.152: v31.45,46.48 31.45,45.41 IC1.1 | v39.12,46.23 41.86,46.23 47.6,51.97 47.6,52.27 U$14.1 47.75,52.43 46.84,53.34 44.55,53.34 43.94,52.73 43.94,52.43 U$14.4
  Bottom 0.152: v39.12,46.23 31.7,46.23 v31.45,46.48
GND  (via drill 0.35)
  Top 0.152: 40.77,47.52 C11.1 | 33.88,51.05 IC1.16 | R5.1 53.24,60.66 49.58,60.66 R8.2 49.43,60.5 46.23,60.5 42.11,56.39 | 38.76,55.93 38.76,55.02 38.61,54.86 35.56,54.86 C8.2 | 38.76,55.93 37.54,57.15 J1.SH1 | BOOT.2 26.57,56.39 30.99,56.39 J1.SH2 | 38.76,55.93 39.06,56.24 41.96,56.24 RESET.1 42.11,56.39 | 36.42,37.69 39.37,34.75 C10.1 v39.37,34.67 39.37,34.59 39.5,34.47 U3.15 39.98,27.35 39.98,25.45 34.65,20.12 34.65,19.01 U3.GND | 58.42,32.92 CN1.4 | 43.08,9.93 U3.1 | v34.04,30.25 33.91,30.38 33.91,31.6 TB1.P$18 | C1.2 42.11,54.61 42.11,56.39 | R1.1 61.31,22.8 61.31,32.26 v60.68,32.89 | U1.15 44.44,31.62 45.72,31.62 45.72,32.51 U1.3 | R21.1 v56.39,16.51 v52.96,16.51 R18.1 | TB1.P$10 32.02,37.83
  Top 0.406: C9.2 31.19,55.41 J1.SH2 30.29,58.04 J1.SH6 v30.35,59.69 32.89,59.69 32.99,59.59 | J1.5 32.99,59.59 | 32.99,59.59 J1.SH5 v33.15,59.69 J1.SH4 v35.56,59.69 v38.23,59.69 J1.SH3 38.29,58.04 J1.SH1 | TB1.P$9 TB1.P$10 | v33.15,50.04 33.35,50.24 33.67,50.24 33.97,50.53 IC1.16
  Top 0.508: 32.02,37.83 33.02,36.83 | 33.02,36.83 35.56,36.83 36.42,37.69 36.57,37.84 36.57,39.16 36.56,39.17 TB1.P$3 TB1.P$4 | C6.2 29.63,36.83 33.02,36.83 | C5.2 45.72,8.11 47.96,5.87 57.24,5.87 58.26,6.88 58.26,9.37 57.57,10.06 55.76,10.06 I2CPIN1.3 | R21.1 56.39,16.47 v56.39,14.25
  Top 0.813: R17.1 14.22,15.88 14.15,15.81 14.15,13.77 15.04,12.88 | 15.04,12.88 C4.- | C7.2 44.51,31.43 44.83,31.75 44.83,32.63 | 44.83,32.63 U1.3 45.21,32.64 v46.99,30.86 | 44.83,32.63 44.83,33.52 U1.16 42.61,34.17 C13.2 41.22,34.69 C10.1 | R6.1 58.42,35.22 58.42,32.92 | CN1.4 57.34,31.88 U1.7 52.96,31.88 v49.91,28.83 49.78,28.7 U1.1 | J1.SH1 v37.35,57.14 v37.34,57.15 | J1.SH2 v31.24,57.15 | v14.99,12.81 15.04,12.86 15.04,12.88
  Top 1.27: C5.2 43.9,9.95 43.88,9.93 43.33,9.93 | 43.08,9.93 33.78,9.93 | 33.78,9.93 32.83,9.93 32.68,10.08 U3.38 17.84,10.08 C4.- 17.12,5.74 GND.P$1 | U3.GND 33.78,9.93
  Bottom 0.152: U$17.CASE4 18.23,13.9 15.62,16.51 15.62,17.07 U$17.6 | v34.04,30.25 33.91,30.25 33.91,18.41 34.29,18.03 v34.29,17.78 | CN3.4 8.61,25.18 U$17.CASE3 | v42.11,47.4 44.55,47.4 45.47,48.31 46.84,48.31 58.42,36.73 CN1.4 58.49,32.89 v60.68,32.89 | v49.66,30.73 47.88,30.73 47.88,30.86 | v17.78,1.78 18.81,2.81 U$17.CASE1
  Bottom 0.508: U$17.CASE3 8.61,12.95 8.61,3.54 8.64,3.51 8.64,2.66 | U$17.CC2 U$17.CASE1 19.41,2.36 10.57,2.36 10.26,2.66 8.64,2.66 | U$17.CASE4 20.11,12.46 | 8.64,2.66 7.35,2.66 7.05,2.36 U$17.CASE2 | v56.39,14.25 56.39,10.69 I2CPIN1.3
  Bottom 0.61: U$17.CASE4 v14.99,12.81 8.75,12.81 8.61,12.95
  Bottom 0.813: v49.91,28.83 47.88,30.86 v46.99,30.86
  other vias: 35.51,46.79 51.43,7.62 50.8,10.79 47.94,16.26 47.37,11.3 52.45,48.64 56.52,43.81 26.54,18.29 26.67,15.11 22.99,17.27 44.13,23.05 45.85,21.34 52.83,35.05 49.53,35.18 49.53,32.77 52.83,32.89 52.83,30.48 52.58,28.96 14.35,8.51 21.21,8.51 14.35,1.65 21.21,1.65 17.91,8.51 21.21,5.08 14.35,5.08 17.78,5.08 31.11,15.11 36.45,15.11 36.45,20.45 31.11,20.45 25.02,46.61 26.29,37.08 14.6,26.16 13.08,24.51 16.26,23.5 45.21,34.42 45.21,31.24 55.37,33.02 55.37,30.73 41.66,35.18 41.66,31.24 26.42,11.3 41.27,11.3 33.91,11.05 32.64,37.59 35.81,37.59 32.64,35.94 35.81,35.94 48.51,14.1 48.51,12.45 57.28,23.37 58.67,23.37 46.74,38.23 48.26,38.23 21.46,29.84 48.26,18.92 48.89,18.29 48.83,10.29 59.69,18.29 64.01,20.32 63.12,20.07 33.97,51.94 35.18,48.39 38.35,48.39 32,50.04 40.77,47.5 32.26,44.32 34.04,43.18 35.69,44.2 38.73,50.29 39.5,51.18 43.94,50.04 45.72,51.05 39.24,53.72 42.54,50.42 42.67,53.09 38.35,46.86 39.75,45.21 41.91,45.21 42.8,46.35 13.59,54.48 16.89,54.48 16.64,57.91 13.84,57.91 18.92,56.9 18.8,53.85 25.27,51.69 28.07,51.18 30.73,51.69 10.41,43.81 17.78,49.4 54.48,54.36 57.91,52.7 57.91,51.31 44.7,45.34 16.26,15.88 18.92,15.88 18.29,22.23 19.69,23.75 5.33,9.53 11.56,9.53
  pour Top: -13.97,66.04 -13.97,-10.16 83.82,-10.16 83.82,66.04
  pour Bottom: -20.32,71.12 -20.32,-7.62 86.36,-7.62 86.36,71.12 73.66,71.12
IO2  (via drill 0.35)
  Top 0.152: U$6.P$1 v17.78,36.83 | v28.7,24.89 28.7,25.27 24.44,29.54 22.66,29.54 22.28,29.16 v20.37,29.16 | v28.19,28.08 U3.24
  Bottom 0.152: v17.78,36.83 20.37,34.24 v20.37,29.16 | v28.19,28.08 28.19,25.4 v28.7,24.89
IO12  (via drill 0.35)
  Top 0.152: 44.27,25.86 43.54,26.59 43.31,26.59 v43.29,26.59 U3.14 43.12,26.92 44.04,26 44.13,26 44.27,25.86 44.27,24.33 48.78,19.81 v49.21,19.81 | v64.9,14.35 65,14.25 SW.L1
  Bottom 0.152: v49.21,19.81 59.44,19.81 v64.9,14.35
N$1
  Top 0.152: R1.2 65,20.81 SW.L2 SW.2
N$2
  Top 0.406: J1.2 34.85,56.92 34.85,56.06 34.29,55.5 R10.1
N$3
  Top 0.152: TB1.P$13 30.9,31.83 31.02,31.83
  Top 0.508: TB1.P$14 30.83,31.64 31.02,31.83 31.02,33.53 | TB1.P$24 37.84,31.66 37.84,32.85 36.24,34.44 31.93,34.44 31.02,33.53 | C6.1 29.83,34.71 31.02,33.53
  Top 1.27: U$16.P$2 25.64,34.71 C6.1
N$4
  Top 0.813: 54.18,37.47 U1.6 54.95,38.06 R6.2
N$5
  Top 0.406: R9.1 33.02,55.74 33.26,55.98 33.99,55.98 34.2,56.19 34.2,56.92 J1.3
N$6
  Top 0.152: 56.13,18.99 Q3.C | 58.13,17.75 Q3.B
  Top 0.508: Q3.C 57.53,19.05 Q3.B 58.48,16.86 R21.2 | Q2.B 55.24,18.1 56.13,18.99
N$7
  Top 0.406: READY.C R5.2
N$8
  Top 0.152: R18.2 50.87,16.86
  Top 0.508: R18.2 51.22,18.7 Q2.C 54.09,19.05 54.51,19.46 54.51,20.63 Q1.1
N$10
  Top 0.406: RX.A R11.2
N$12  (via drill 0.35)
  Top 0.152: v38.33,45.41 37.24,45.41 IC1.10 | v27.03,53.65 23.67,53.65 17.88,59.44 RX.C
  Bottom 0.152: v38.33,45.41 39.09,45.41 39.98,46.3 39.98,48.16 35.56,52.58 28.09,52.58 v27.03,53.65
N$13
  Top 0.406: TX.A R12.2
N$14
  Top 0.406: POWER.C R8.1
N$19
  Top 0.152: IC1.17 33.27,51.21 33.27,51.66 32.66,52.27 24.44,52.27 18.19,58.52 13.61,58.52 12.7,59.44 TX.C
PWM0  (via drill 0.35)
  Top 0.152: v27.03,22.71 24.84,22.71 U3.28 | TB1.P$23 37.08,31.55 37.08,29.87 36.37,29.16 31.75,29.16 v31.5,29.41
  Bottom 0.152: v27.03,22.71 27.1,22.78 30.02,22.78 31.5,24.26 v31.5,29.41
PWM1  (via drill 0.35)
  Top 0.152: v37.69,22.25 40.89,19.05 42.67,19.05 U3.8 | 32.05,31.7 TB1.P$15 v32.01,30.14 | v32.89,25.27 v34.65,25.3
  Bottom 0.152: v37.69,22.25 v34.65,25.3 | v32.01,30.14 32.01,29.81 32.31,29.52 32.31,25.86 v32.89,25.27
RST  (via drill 0.35)
  Top 0.152: U$14.6 45.16,46.63 45.16,48.31 48.36,51.51 48.36,53.65 45.77,56.24 R15.1 45.62,56.39 44.4,56.39 RESET.3 44.25,54.81 C1.1 | v43.79,45.26 43.79,46.48 U$14.5 | U3.3 42.72,12.62 v42.72,12.68
  Top 0.406: U$14.6 U$14.5
  Bottom 0.152: v42.72,12.68 42.11,13.28 42.11,25.3 37.13,30.28 37.13,38.61 v43.79,45.26
RTS
  Top 0.152: IC1.2 32.05,45.41 32.05,47.4 32.31,47.65 39.42,47.65 40.06,48.28 41.33,48.28 45.01,51.97 45.01,52.27 U$14.3 45.16,52.27 46.23,52.27 U$14.2
RX  (via drill 0.35)
  Top 0.152: IC1.20 31.43,49.54 v30.18,48.28 | v20.62,24.99 20.62,23.16 16.31,18.85 16.31,18.11 16.74,17.68 20.3,17.68 22.81,15.16 U3.34
  Bottom 0.152: v30.18,48.28 24.74,42.85 24.74,28.8 20.93,24.99 v20.62,24.99
SCL  (via drill 0.35)
  Top 0.152: 42.82,23.93 U3.12 44.02,24.05 48.96,19.11 49.53,18.54 v49.53,14.58 49.53,14.48 | 49.43,12.04 R3.2
  Top 0.508: R3.2 49.59,11.77 I2CPIN1.1
  Bottom 0.152: v49.53,14.58 49.53,8.95 I2CPIN1.1
SDA
  Top 0.152: 48.89,7.77 50.8,7.77 51.87,8.84 I2CPIN1.2 | 48.89,7.77 48.82,7.77 | U3.11 42.82,22.71 43.64,22.71 48.51,17.83 48.51,14.99 47.88,14.35 47.88,12.22 48.24,11.85 48.24,8.39 48.73,7.9 48.77,7.9 48.89,7.77
  Top 0.508: R4.2 52.09,11.8 I2CPIN1.2
SDCHECK  (via drill 0.35)
  Top 0.152: v35.56,12.34 39.52,16.31 42.67,16.31 U3.6 | v21.69,15.34 19.96,17.07 v19.71,17.07
  Bottom 0.152: v35.56,12.34 24.69,12.34 v21.69,15.34 | v19.71,17.07 18.95,17.07 U$17.CC1
  Bottom 0.508: U$17.CC1 18.81,17.91 18.81,19.2 R24.2
SDCLK  (via drill 0.35)
  Top 0.152: v20.02,20.12 24.69,20.12 U3.30
  Bottom 0.152: v20.02,20.12 19.71,20.12 19.56,20.27 15.9,20.27 15.29,19.66 R13.1
  Bottom 0.508: U$17.5 14.9,17.45 14.9,17.88 15.24,18.21 R13.1
SDCS  (via drill 0.35)
  Top 0.152: v20.62,15.24 20.22,14.83 v16.41,14.83 | 29.41,28.19 U3.23 v29.46,28.08
  Bottom 0.152: v20.62,15.24 21.84,16.46 21.84,20.42 25.12,23.7 28.68,23.7 29.46,24.49 v29.46,28.08 | v16.41,14.83 13.26,14.83 11.18,16.92 U$17.2
  Bottom 0.406: R20.2 11.43,17.28
  Bottom 0.508: 11.43,17.28 U$17.2
SDDATA1
  Bottom 0.508: U$17.1 R22.1
SDDATA2
  Bottom 0.508: R23.1 17.78,17.19 U$17.8
SDMISO  (via drill 0.35)
  Top 0.152: v16.92,18.29 17.53,18.9 24.69,18.9 U3.31
  Bottom 0.152: v16.92,18.29 16.51,18.29
  Bottom 0.508: R14.1 16.51,18.29 16.51,17.36 U$17.7
SDMOSI  (via drill 0.35)
  Top 0.152: U3.37 23.96,11.35 22.53,12.57 16.26,12.57 15.04,13.79 v15.04,15.44
  Bottom 0.152: U$17.3 12.24,16.92 13.72,15.44 v15.04,15.44
  Bottom 0.508: R19.1 12.7,17.45 U$17.3
STBY  (via drill 0.35)
  Top 0.152: v46.23,47.7 53.24,54.71 READY.A | v36.47,30.18 36.22,30.43 35,30.43 34.65,30.79 34.65,31.55 TB1.P$19 | 25.65,21.49 24.84,21.49 U3.29 v25.29,21.51 | v33.35,21.59 v39.4,26.82
  Bottom 0.152: v46.23,47.7 45.31,47.7 36.47,38.86 v36.47,30.18 38.38,28.27 39.38,27.33 v39.4,26.82 | v25.29,21.51 25.27,21.59 v33.35,21.59
SVN  (via drill 0.35)
  Top 0.152: R2.1 62,11.95 SW.1 61.97,13.46 61.75,13.46 v59.97,15.24 | U3.5 42.86,15.24 v47.96,15.24
  Bottom 0.152: v47.96,15.24 v59.97,15.24
TX  (via drill 0.35)
  Top 0.152: v33.27,44.42 33.27,45.26 IC1.4 | v29.26,38.08 24.11,38.08 v23.52,37.49 | v19.71,24.99 15.11,20.4 15.11,16.18 15.72,15.57 15.72,14.66 16.49,13.89 U3.35
  Bottom 0.152: v33.27,44.42 33.27,42.09 v29.26,38.08 | v23.52,37.49 23.52,28.8 v19.71,24.99
V+
  Top 0.152: 11.07,25.27 11.07,25.37 11.2,25.5
  Top 0.813: 11.07,23.37 14.06,23.37 R7.2
  Top 2.54: 11.2,25.5 U$16.P$1 | EM.P$1 11.07,16.03 11.07,23.37 11.07,25.27
V+MEASUR  (via drill 0.35)
  Top 0.152: v23.5,20.95 21.18,23.27 21.18,25.22 20.86,25.55 19.33,25.55 14.22,20.45 | v38.23,16.76 39.16,17.7 U3.7
  Top 0.813: R7.1 14.22,20.45 R17.2
  Bottom 0.152: v23.5,20.95 26.67,20.95 30.86,16.76 v38.23,16.76
VBUS1
  Top 0.406: J1.1 35.98,56.62 35.98,56.19 36.72,55.46 D1.1
VIN  (via drill 0.35)
  Top 0.152: U1.14 45.08,28.7 45.21,28.56 U1.2
  Top 0.508: Q1.2 53.85,21.87 53.85,20.58 Q2.E 52.57,20.7 49.17,20.7 v47.64,22.23
  Top 0.813: C7.1 44.13,29.53 U1.14 | U1.2 45.21,26.29 U1.13 | C4.+ v14.12,10.18
  Top 1.27: 14.35,11.03 C4.+ 14.12,10.31 VIN.P$1 | v47.64,22.23 45.21,24.65 45.21,26.29 | U1.13 45.2,28.57 45.08,28.7 | U1.2 45.21,29.21 45.47,29.46 45.4,29.53 C7.1
  Bottom 1.27: v14.12,10.18 14.5,9.8 43.8,9.8 46.83,12.83 46.83,20.19 47.64,21.01 v47.64,22.23

### Text on the board
tPlace: BOOT | RESET | A | 3.3V | B | GND | GND | VIN | EMS
bPlace: GND | A | 3.3V | B | SCL | SDA | GND | 3.3V